# Altium schematic sheet Charger.SchDoc
size A
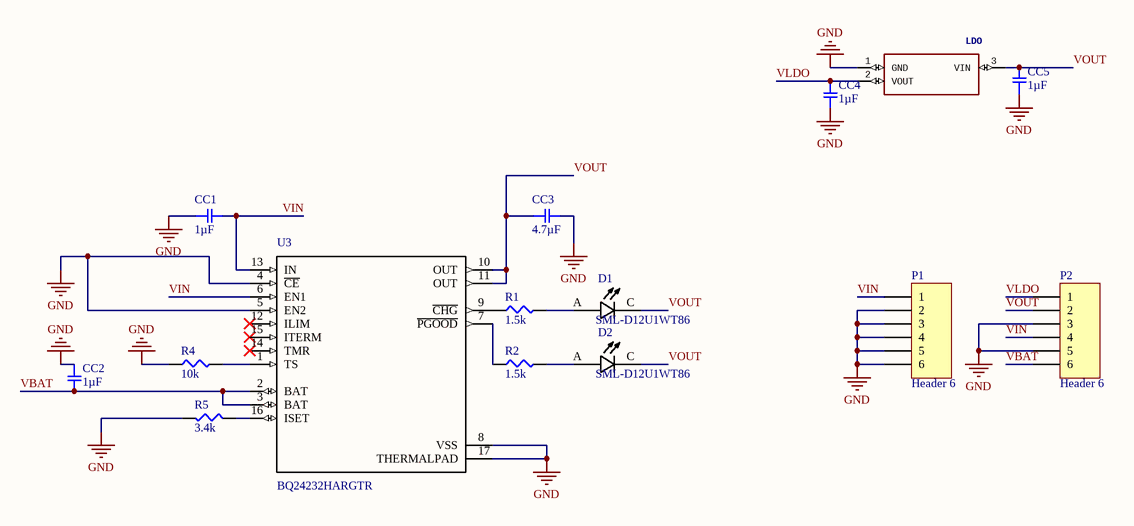
[diagram p0: Charger.SchDoc]

## Parts
CC1  1µF  [SMD-0603C]
CC2  1µF  [SMD-0603C]
CC3  4.7µF  [SMD-0603C]
CC4  1µF  [SMD-0603C]
CC5  1µF  [SMD-0603C]
D1  SML-D12U1WT86  [*LED_SML-D12Y1WT86_SML-D12U1WT86(Primary)]
D2  SML-D12U1WT86  [*LED_SML-D12Y1WT86_SML-D12U1WT86(Primary)]
LDO  250mA 3.3V Ultra Low IQ LDO Reg. SOT23 DiodesZetex AP2138N-3.3TRG1, Low Noise LDO Voltage Regulator, 250 (Min)mA, 3.3 V +/-2%, 2.5 to 6.6 Vin, 3-Pin SOT-23Source:  Datasheet  [SOT95P282X145-3N]  (value not drawn)
P1  Header 6  [HDR1X6]
P2  Header 6  [HDR1X6]
R1  1.5k  [SMD-0603-RES]
R2  1.5k  [SMD-0603-RES]
R4  10k  [SMD-0603-RES]
R5  3.4k  [SMD-0603-RES]
U3  BQ24232HARGTR  [*QFN50P300X300X100-17N]

## Nets
GND: CC1.1 CC2.1 CC3.2 CC4.2 CC5.1 LDO.1(GND) P1.2 P1.3 P1.4 P1.5 P1.6 P2.3 P2.5 R4.1 R5.2 U3.4(~{CE}) U3.5(EN2) U3.8(VSS) U3.17(THERMALPAD)
VBAT: CC2.2 P2.6 U3.2(BAT) U3.3(BAT)
VIN: CC1.2 P1.1 P2.4 U3.6(EN1) U3.13(IN)
VLDO: CC4.1 LDO.2(VOUT) P2.1
VOUT: CC3.1 CC5.2 D1.C D2.C LDO.3(VIN) P2.2 U3.10(OUT) U3.11(OUT)
NetD1_A: D1.A R1.2
NetD2_A: D2.A R2.2
NetR1_1: R1.1 U3.9(~{CHG})
NetR2_1: R2.1 U3.7(~{PGOOD})
NetR4_2: R4.2 U3.1(TS)
NetR5_1: R5.1 U3.16(ISET)

Not connected (* = marked no-connect by the designer): U3 12(ILIM)* 14(TMR)* 15(ITERM)*

## Library data of the parts
CC1 CC2 CC4 CC5 = GRM188R61A105KA61D: CAP CER 1UF 10V X5R 0603; Manufacturer: Murata Electronics North America; Factory Stock: 0; Unit Price (USD): 0.1; Minimum Quantity: 1; Tolerance: ±10%; Datasheets: http://www.murata.com/~/media/webrenewal/support/library/catalog/products/capacitor/mlcc/c02e.pdf; Image: //media.digikey.com/Renders/Murata%20Renders/ZRB-SERIES-0402.jpg; Digi-Key Part Number: 490-1543-1-ND; Part Number: GRM188R61A105KA61D; Quantity Available: 2638296; @ qty: 0; Packaging: Cut Tape (CT); Series: GRM; Part Status: Active; Value: 1µF; Voltage: 10V; Temperature Coefficient: X5R; Operating Temperature: -55°C ~ 85°C; Features: -; Ratings: -; Applications: General Purpose; Mounting Type: Surface Mount, MLCC; Package / Case: 0603 (1608 Metric); Size / Dimension: 0.063" L x 0.031" W (1.60mm x 0.80mm); Height - Seated (Max): -; Thickness (Max): 0.035" (0.90mm); Lead Spacing: -; Lead Style: -
CC3 = GRM185R60G475ME15D: CAP CER 4.7UF 4V X5R 0603; Manufacturer: Murata Electronics North America; Factory Stock: 0; Unit Price (USD): 0.25; Minimum Quantity: 1; Tolerance: ±20%; Datasheets: http://www.murata.com/~/media/webrenewal/support/library/catalog/products/capacitor/mlcc/c02e.pdf; Image: //media.digikey.com/Renders/Murata%20Renders/ZRB-SERIES-0402.jpg; Digi-Key Part Number: 490-3891-1-ND; Part Number: GRM185R60G475ME15D; Quantity Available: 29936; @ qty: 0; Packaging: Cut Tape (CT); Series: GRM; Part Status: Active; Value: 4.7µF; Voltage: 4V; Temperature Coefficient: X5R; Operating Temperature: -55°C ~ 85°C; Features: -; Ratings: -; Applications: General Purpose; Mounting Type: Surface Mount, MLCC; Package / Case: 0603 (1608 Metric); Size / Dimension: 0.063" L x 0.031" W (1.60mm x 0.80mm); Height - Seated (Max): -; Thickness (Max): 0.020" (0.50mm); Lead Spacing: -; Lead Style: -
D1 D2 = SML-D12U1WT86: SML-D12 Series Red 0603 Diffused 63 mcd 2.2 V Surface Mount LED; MF: Rohm; Digi-Key_Purchase_URL: https://www.digikey.com/product-detail/en/rohm-semiconductor/SML-D12U1WT86/SML-D12U1WT86CT-ND/5843858?utm_source=snapeda&utm_medium=aggregator&utm_campaign=symbol; Digi-Key_Part_Number: SML-D12U1WT86CT-ND; Package: 0603 Rohm; SnapEDA_Link: https://www.snapeda.com/parts/SML-D12U1WT86/Rohm/view-part/?ref=snap; MP: SML-D12U1WT86; Value: *
LDO = AP2138N-3.3TRG1: Manufacturer_Name: Diodes Inc.; GateName_1: G$1; Allied_Number: 70551004; SymbolName_1: AP2138N-3.3TRG1; LibraryName: AP2138N-3.3TRG1; DeviceSetName: AP2138N-3.3TRG1; Package: SOT95P282X145-3N; Manufacturer_Part_Number: AP2138N-3.3TRG1; Mouser_Part_Number: 621-AP2138N-3.3TRG1; Mouser_Price-Stock: https://www.mouser.com/Search/Refine.aspx?Keyword=621-AP2138N-3.3TRG1; RS_Part_Number: 9210398P; RS_Price-Stock: http://uk.rs-online.com/web/p/products/9210398P; Allied_Price-Stock: https://www.alliedelec.com/diodesinc-ap2138n-3-3trg1/70551004/; Height: 1.45mm
P1 P2 = Header 6: Header, 6-Pin; LatestRevisionDate: 17-Jul-2002; LatestRevisionNote: Re-released for DXP Platform.; Publisher: Altium Limited
R1 R2 = ERJ-3EKF1501V: RES SMD 1.5K OHM 1% 1/10W 0603; Manufacturer: Panasonic Electronic Components; Factory Stock: 0; Unit Price (USD): 0.00379; @ qty: 1500; Minimum Quantity: 1; Power (Watts): 0.1W, 1/10W; Temperature Coefficient: ±100ppm/°C; Part Number: ERJ-3EKF1501V; Datasheets: http://industrial.panasonic.com/www-cgi/jvcr13pz.cgi?E+PZ+3+AOA0002+ERJ3EKF1501V+7+WW; Image: //media.digikey.com/Photos/Panasonic%20Photos/MFG_ERJ-P6W%20Series.jpg; Digi-Key Part Number: P1.50KHCT-ND; Quantity Available: 417970; Packaging: Cut Tape (CT); Series: ERJ; Part Status: Active; Value: 1.5k; Tolerance: ±1%; Composition: Thick Film; Features: Automotive AEC-Q200; Operating Temperature: -55°C ~ 155°C; Package / Case: 0603 (1608 Metric); Supplier Device Package: 0603; Size / Dimension: 0.063" L x 0.031" W (1.60mm x 0.80mm); Height - Seated (Max): 0.022" (0.55mm); Number of Terminations: 2; Failure Rate: -
R4 = ERJ-PA3J103V: RES SMD 10K OHM 5% 1/4W 0603; Manufacturer: Panasonic Electronic Components; Factory Stock: 0; Unit Price (USD): 0.01646; @ qty: 1500; Minimum Quantity: 1; Power (Watts): 0.25W, 1/4W; Temperature Coefficient: ±200ppm/°C; Part Number: ERJ-PA3J103V; Datasheets: https://industrial.panasonic.com/cdbs/www-data/pdf/RDA0000/AOA0000C243.pdf; Image: //media.digikey.com/Photos/Panasonic%20Photos/MFG_ERJ-P6W%20Series.jpg; Digi-Key Part Number: P10KBZCT-ND; Quantity Available: 26345; Packaging: Cut Tape (CT); Series: ERJ; Part Status: Active; Value: 10k; Tolerance: ±5%; Composition: Thick Film; Features: Automotive AEC-Q200, Pulse Withstanding; Operating Temperature: -55°C ~ 155°C; Package / Case: 0603 (1608 Metric); Supplier Device Package: 0603; Size / Dimension: 0.063" L x 0.031" W (1.60mm x 0.80mm); Height - Seated (Max): 0.022" (0.55mm); Number of Terminations: 2; Failure Rate: -
R5 = ERJ-3EKF3401V: RES SMD 3.4K OHM 1% 1/10W 0603; Manufacturer: Panasonic Electronic Components; Factory Stock: 0; Unit Price (USD): 0.00379; @ qty: 1500; Minimum Quantity: 1; Power (Watts): 0.1W, 1/10W; Temperature Coefficient: ±100ppm/°C; Part Number: ERJ-3EKF3401V; Datasheets: http://industrial.panasonic.com/www-cgi/jvcr13pz.cgi?E+PZ+3+AOA0002+ERJ3EKF3401V+7+WW; Image: //media.digikey.com/Photos/Panasonic%20Photos/MFG_ERJ-P6W%20Series.jpg; Digi-Key Part Number: P3.40KHCT-ND; Quantity Available: 58954; Packaging: Cut Tape (CT); Series: ERJ; Part Status: Active; Value: 3.4k; Tolerance: ±1%; Composition: Thick Film; Features: Automotive AEC-Q200; Operating Temperature: -55°C ~ 155°C; Package / Case: 0603 (1608 Metric); Supplier Device Package: 0603; Size / Dimension: 0.063" L x 0.031" W (1.60mm x 0.80mm); Height - Seated (Max): 0.022" (0.55mm); Number of Terminations: 2; Failure Rate: -
U3 = BQ24232HARGTR: USB-Friendly Lithium-Ion Battery Charger and Power-Path Management IC 0.5A 10.5V OVP 16-Pin QFN T/R; MF: Texas Instruments; SnapEDA_Link: https://www.snapeda.com/parts/BQ24232HARGTR/Texas%20Instruments/view-part/?ref=snap; Digi-Key_Part_Number: 296-49554-1-ND; Digi-Key_Purchase_URL: https://www.digikey.com/product-detail/en/texas-instruments/BQ24232HARGTR/296-49554-1-ND/9462552?utm_source=snapeda&utm_medium=aggregator&utm_campaign=symbol; MP: BQ24232HARGTR; Package: VFQFN-16 Texas Instruments; Value: *